# Altium schematic sheet BMS_TOP.SchDoc
size B; Organization: Altium Limited; Address1: L3, 12a Rodborough Rd; Address2: Frenchs Forest; Address3: NSW; Address4: Australia 2086
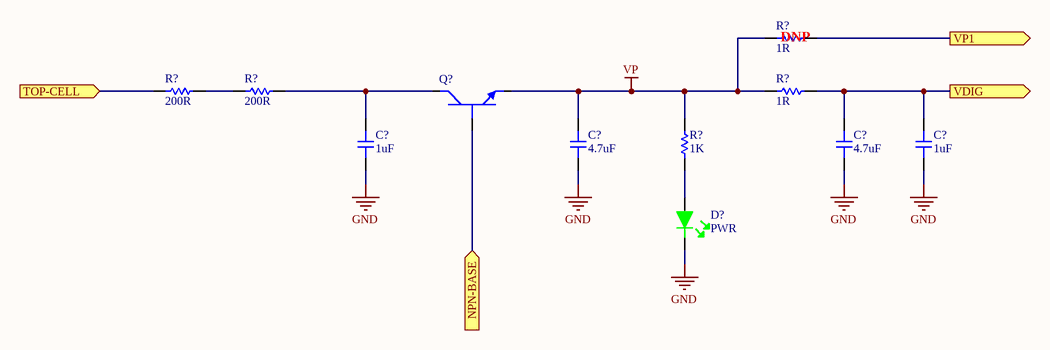
[diagram p0: BMS_TOP.SchDoc]

## Parts
(Parts that share a designator on the sheet are numbered #1, #2 ... from top to bottom, then left to right.)
C?#1  1uF  [CAP-0805]
C?#2  4.7uF  [CAP-0805]
C?#3  4.7uF  [CAP-0805]
C?#4  1uF  [CAP-0805]
D?  PWR  [LED-0603]
Q?  ZXTN4004KTCDICT-ND  [DPAK-TO252]  (value not drawn)
R?#1  1R  [RES-0603]
R?#2  200R  [RES-2512]
R?#3  200R  [RES-2512]
R?#4  1R  [RES-0603]
R?#5  1K  [RES-0603]

## Ports
NPN-BASE (in), TOP-CELL (in), VDIG (out), VP1 (out)

## Nets
GND: C?#1.1 C?#2.1 C?#3.1 C?#4.1 D?.2
VP: C?#2.2 Q?.3 R?#1.1 R?#4.1 R?#5.2
NPN-BASE: Q?.1 ; port NPN-BASE
TOP-CELL: R?#2.1 ; port TOP-CELL
VDIG: C?#3.2 C?#4.2 R?#4.2 ; port VDIG
VP1: R?#1.2 ; port VP1
NetC?#1_2: C?#1.2 Q?.2 R?#3.2
NetD?_1: D?.1 R?#5.1
NetR?#2_2: R?#2.2 R?#3.1

## Notes on the sheet
- (near R?#1) DNP
- Title
- Size:
- Date:
- Tabloid
- Number:
- Time:
- Revision:
- Sheet
- of
- File:

## Library data of the parts
C?#1 = 0805-1uF-50V: CAP CER 1UF 50V X5R 0805; Manufacturer: KEMET; Manufacturer Part Number: C0805C105K5PACTU; Dielectric Material: Ceramic; Tolerance: 10%; Supplier 1: Digi-Key; Stock 1: 7193; Pricing 1: 1=0.33, 10=0.23, 100=0.1378, 500=0.10334, 1000=0.08726 (USD); Mount: Surface Mount; Case/Package: 0805; Weight: 0.000194oz; Case Code (Metric): 2012; Case Code (Imperial): 0805; Min Operating Temperature: -55°C; Max Operating Temperature: 85°C; Voltage Rating: 50V; Dielectric: X5R; Packaging: Tape and Reel; Termination: SMD/SMT; Voltage Rating (DC): 50V; Package Quantity: 2500; Capacitance: 1uF; Length: 0.079inch; Width: 0.049inch; Thickness: 0.055inch; REACH SVHC: No SVHC; Lead Free: Lead Free; ComponentLink1URL: https://api.kemet.com/component-edge/download/datasheet/C0805C105K5PAC7800.pdf?src-supplier=Digi-Key; ComponentLink1Description: https://api.kemet.com/component-edge/download/datasheet/C0805C105K5PAC7800.pdf?src-supplier=Digi-Key; ComponentLink2URL: http://www.farnell.com/datasheets/2746140.pdf?src-supplier=Farnell; ComponentLink2Description: http://www.farnell.com/datasheets/2746140.pdf?src-supplier=Farnell; ComponentLink3URL: http://www.mouser.com/ds/2/212/KEM_C1006_X5R_SMD-1103249.pdf?src-supplier=Mouser; ComponentLink3Description: http://www.mouser.com/ds/2/212/KEM_C1006_X5R_SMD-1103249.pdf?src-supplier=Mouser; ComponentLink4URL: http://www.farnell.com/datasheets/2746140.pdf?src-supplier=Newark; ComponentLink4Description: http://www.farnell.com/datasheets/2746140.pdf?src-supplier=Newark; ComponentLink5URL: http://www.farnell.com/datasheets/2032728.pdf?src-supplier=Element14; ComponentLink5Description: http://www.farnell.com/datasheets/2032728.pdf?src-supplier=Element14; Supplier Part Number 1: 399-15436-6-ND
C?#2 C?#3 = 0805-4.7uF-16V: CAP CER 4.7UF 16V X5R 0805; Manufacturer: KEMET; Manufacturer Part Number: C0805C475K4PACTU; Dielectric Material: Ceramic; Tolerance: 10%; Supplier 1: Digi-Key; Stock 1: 96594; Pricing 1: 1=0.24, 10=0.168, 100=0.0951, 500=0.0671, 1000=0.05872 (USD); Mount: Surface Mount; Case/Package: 0805; Min Operating Temperature: -55°C; Max Operating Temperature: 85°C; Capacitance: 4.7uF; Packaging: Tape and Reel; Dielectric: X5R; Voltage: 16V; Termination: SMD/SMT; Voltage Rating (DC): 16V; Length: 2mm; Height: 1.25mm; Depth: 1.25mm; Radiation Hardening: No; Lead Free: Lead Free; ComponentLink1URL: http://capacitoredge.kemet.com/capedge2/DataSheet?pn=C0805C475K4PAC7800&src-supplier=Avnet+Europe; ComponentLink1Description: http://capacitoredge.kemet.com/capedge2/DataSheet?pn=C0805C475K4PAC7800&src-supplier=Avnet+Europe; ComponentLink2URL: https://www.verical.com/server-webapp/html/getDatasheet?partID=319476&src-supplier=Verical; ComponentLink2Description: https://www.verical.com/server-webapp/html/getDatasheet?partID=319476&src-supplier=Verical; Supplier Part Number 1: 399-8101-6-ND
C?#4 = 0805-1uF-16V: CAP CER 1UF 16V Y5V 0805; Manufacturer: KEMET; Manufacturer Part Number: C0805C105Z4VACTU; Dielectric Material: Ceramic; Tolerance: 80%; Dissipation Factor: 7%; Supplier 1: Digi-Key; Stock 1: 54729; Pricing 1: 1=0.12, 10=0.085, 100=0.0378, 500=0.02702, 1000=0.02124 (USD); Mount: Surface Mount,PCB; Case/Package: 0805; Number of Pins: 2; Case Code (Metric): 2012; Case Code (Imperial): 0805; Contact Material: Tin; Min Operating Temperature: -30°C; Max Operating Temperature: 85°C; Package Quantity: 1; Capacitance: 1uF; Voltage Rating: 16V; Packaging: Tape and Reel; Voltage Rating (DC): 16V; Dielectric: Y5V; Termination: SMD/SMT; Voltage: 16V; Length: 2mm; Height: 1.25mm; Width: 0.049inch; Thickness: 0.055inch; Lead Pitch: 0.75mm; Depth: 1.25mm; Radiation Hardening: No; REACH SVHC: No SVHC; Lead Free: Lead Free; ComponentLink1URL: http://www.farnell.com/datasheets/2739656.pdf?src-supplier=Farnell; ComponentLink1Description: http://www.farnell.com/datasheets/2739656.pdf?src-supplier=Farnell; ComponentLink2URL: http://capacitoredge.kemet.com/capedge2/DataSheet?pn=C0805C105Z4VAC7800&src-supplier=Avnet+Europe; ComponentLink2Description: http://capacitoredge.kemet.com/capedge2/DataSheet?pn=C0805C105Z4VAC7800&src-supplier=Avnet+Europe; ComponentLink3URL: https://www.alliedelec.com/m/d/9bfe7773041ffe9d406e68bc7b377fdd.pdf?src-supplier=Allied+Electronics; ComponentLink3Description: https://www.alliedelec.com/m/d/9bfe7773041ffe9d406e68bc7b377fdd.pdf?src-supplier=Allied+Electronics; ComponentLink4URL: http://www.farnell.com/datasheets/2739656.pdf?src-supplier=Newark; ComponentLink4Description: http://www.farnell.com/datasheets/2739656.pdf?src-supplier=Newark; Supplier Part Number 1: 399-8011-6-ND
D? = LED-Green: LED GREEN CLEAR 0603 SMD; Manufacturer: Wurth Electronics; Manufacturer Part Number: 150060VS75000; Luminous Intensity: 40mcd; Viewing Angle: 140°; Forward Voltage: 2V; Wavelength: 570nm; Lens Style: Clear,Rectangular; Forward Current: 30mA; Test Current: 20mA; Supplier 1: Digi-Key; Stock 1: 118118; Pricing 1: 1=0.14, 50=0.133, 100=0.114, 500=0.099 (USD); Mount: Surface Mount; Case/Package: 0603; Number of Pins: 2; Color: Green; Case Code (Metric): 1608; Case Code (Imperial): 0603; Min Operating Temperature: -40°C; Max Operating Temperature: 85°C; Package Quantity: 1; Packaging: Tape and Reel; Dominant Wavelength: 570nm; Length: 1.6mm; Height: 0.7mm; Width: 0.8mm; REACH SVHC: Unknown; ComponentLink1URL: https://katalog.we-online.de/led/datasheet/150060VS75000.pdf?src-supplier=Digi-Key; ComponentLink1Description: https://katalog.we-online.de/led/datasheet/150060VS75000.pdf?src-supplier=Digi-Key; Supplier Part Number 1: 732-4980-1-ND
Q? = NPN-150V-1A: TRANS NPN 150V 1A TO252; Manufacturer: Diodes; Max Power Dissipation: 3.8W; Number of Elements: 1; hFE Min: 100; Emitter Base Voltage (VEBO): 7V; Element Configuration: Single; Supplier 1: Digi-Key; Manufacturer Part Number: ZXTN4004KTC; Stock 1: 16465; Pricing 1: 1=0.44, 10=0.374, 25=0.3492, 100=0.2595, 250=0.24648, 500=0.20258, 1000=0.16465 (USD); Mount: Surface Mount; Case/Package: TO-252; Number of Pins: 3; Weight: 0.063493oz; Min Operating Temperature: -55°C; Max Operating Temperature: 150°C; Packaging: Tape and Reel; Package Quantity: 2500; Polarity: NPN; Collector Emitter Voltage (VCEO): 150V; Collector Base Voltage (VCBO): 150V; Continuous Collector Current: 1A; Max Collector Current: 1A; Collector Emitter Breakdown Voltage: 150V; Max Breakdown Voltage: 150V; Power Dissipation: 3.8W; Length: 6.7mm; Height: 6.2mm; Width: 2.39mm; Radiation Hardening: No; Lead Free: Lead Free; REACH SVHC: No SVHC; ComponentLink1URL: http://www.mouser.com/ds/2/115/ZXTN4004K-219140.pdf?src-supplier=Mouser; ComponentLink1Description: http://www.mouser.com/ds/2/115/ZXTN4004K-219140.pdf?src-supplier=Mouser; ComponentLink2URL: http://www.diodes.com/datasheets/ZXTN4004K.pdf?src-supplier=Avnet; ComponentLink2Description: http://www.diodes.com/datasheets/ZXTN4004K.pdf?src-supplier=Avnet; ComponentLink3URL: http://www.diodes.com/datasheets/ZXTN4004K.pdf?src-supplier=Avnet+Europe; ComponentLink3Description: http://www.diodes.com/datasheets/ZXTN4004K.pdf?src-supplier=Avnet+Europe; ComponentLink4URL: https://www.diodes.com/assets/Datasheets/ZXTN4004K.pdf?src-supplier=Digi-Key; ComponentLink4Description: https://www.diodes.com/assets/Datasheets/ZXTN4004K.pdf?src-supplier=Digi-Key; Supplier Part Number 1: ZXTN4004KTCDIDKR-ND
R?#1 R?#4 = 0603-1R: RES SMD 1 OHM 1% 1/10W 0603; Manufacturer: Yageo; Manufacturer Part Number: RC0603FR-071RL; Voltage Rating (DC): 50V; Temperature Coefficient: 200ppm/°C; Power Rating: 100mW; Supplier 1: Digi-Key; Stock 1: 9330143; Pricing 1: 1=0.1, 10=0.046, 100=0.0187, 1000=0.0084, 2500=0.00729 (USD); Case/Package: 0603; Number of Pins: 2; Case Code (Imperial): 0603; Case Code (Metric): 1608; Min Operating Temperature: -55°C; Max Operating Temperature: 155°C; Resistance: 1R; Tolerance: 1%; Packaging: Tape and Reel; Composition: Thick Film; Voltage Rating: 50V; Termination: SMD/SMT; Package Quantity: 1; Number of Terminations: 2; Max Power Dissipation: 100mW; Features: Moisture Resistant; Length: 0.063inch; Height: 0.022inch; Width: 0.031inch; Depth: 0.8mm; REACH SVHC: Unknown; Lead Free: Lead Free; ComponentLink1URL: http://www.yageo.com/documents/recent/PYu-RC_Group_51_RoHS_L_10.pdf?src-supplier=Digi-Key; ComponentLink1Description: http://www.yageo.com/documents/recent/PYu-RC_Group_51_RoHS_L_10.pdf?src-supplier=Digi-Key; ComponentLink2URL: http://www.farnell.com/datasheets/2167052.pdf?src-supplier=Element14; ComponentLink2Description: http://www.farnell.com/datasheets/2167052.pdf?src-supplier=Element14; ComponentLink3URL: http://www.farnell.com/datasheets/1868787.pdf?src-supplier=Element14; ComponentLink3Description: http://www.farnell.com/datasheets/1868787.pdf?src-supplier=Element14; Supplier Part Number 1: 311-1.00HRDKR-ND
R?#2 R?#3 = 2512-200R: RES SMD 200 OHM 1% 1W 2512; Manufacturer: Vishay; Manufacturer Part Number: CRCW2512200RFKEG; Temperature Coefficient: 100ppm/°C; Voltage Rating: 500V; Supplier 1: Digi-Key; Stock 1: 27582; Pricing 1: 1=0.38, 10=0.318, 100=0.1242, 1000=0.05198 (USD); Case/Package: 2512; Number of Pins: 2; Weight: 0.001429oz; Contact Plating: Tin; Case Code (Imperial): 2512; Case Code (Metric): 6432; Min Operating Temperature: -55°C; Max Operating Temperature: 155°C; Resistance: 200R; Power Rating: 1W; Tolerance: 1%; Packaging: Tape and Reel; Composition: Thick Film; Number of Terminations: 2; Military Standard: Not; Max Power Dissipation: 1W; Package Quantity: 10; Voltage Rating (DC): 500V; Termination: SMD/SMT; Features: Automotive AEC-Q200; Length: 6.3mm; Height: 0.028inch; Width: 3.15mm; Depth: 3.15mm; Radiation Hardening: No; Lead Free: Lead Free; REACH SVHC: Unknown; ComponentLink1URL: https://www.alliedelec.com/m/d/0c934d6939ccefa68dbe0b96d821c8cf.pdf?src-supplier=Allied+Electronics; ComponentLink1Description: https://www.alliedelec.com/m/d/0c934d6939ccefa68dbe0b96d821c8cf.pdf?src-supplier=Allied+Electronics; ComponentLink2URL: http://www.vishay.com/docs/20035/dcrcwe3.pdf?src-supplier=Digi-Key; ComponentLink2Description: http://www.vishay.com/docs/20035/dcrcwe3.pdf?src-supplier=Digi-Key; ComponentLink3URL: http://www.vishay.com/docs/20035/dcrcwe3.pdf?src-supplier=Avnet; ComponentLink3Description: http://www.vishay.com/docs/20035/dcrcwe3.pdf?src-supplier=Avnet; ComponentLink4URL: http://www.vishay.com/docs/20035/dcrcwe3.pdf?src-supplier=Future+Electronics; ComponentLink4Description: http://www.vishay.com/docs/20035/dcrcwe3.pdf?src-supplier=Future+Electronics; Supplier Part Number 1: 541-200AFDKR-ND
R?#5 = 0603-1KR: RES SMD 1K OHM 1% 1/10W 0603; Manufacturer: Vishay Dale; Manufacturer Part Number: CRCW06031K00FKEA; Resistance: 1kR; Power Rating: 100mW; Voltage Rating: 75V; Temperature Coefficient: 100ppm/°C; Supplier 1: Digi-Key; Stock 1: 671453; Pricing 1: 1=0.1, 10=0.034, 100=0.0139, 1000=0.00623, 2500=0.0054 (USD); Mount: Surface Mount; Case/Package: 0603; Number of Pins: 2; Weight: 7.1E-05oz; Case Code (Metric): 1608; Case Code (Imperial): 0603; Contact Plating: Tin; Min Operating Temperature: -55°C; Max Operating Temperature: 155°C; Composition: Thick Film; Tolerance: 1%; Packaging: Tape and Reel; Package Quantity: 10; Number of Terminations: 2; Termination: SMD/SMT; Military Standard: Not; Max Power Dissipation: 100mW; Voltage Rating (DC): 75V; Features: Automotive AEC-Q200; Length: 1.55mm; Height: 0.45mm; Width: 0.033inch; Depth: 0.85mm; Radiation Hardening: No; REACH SVHC: Unknown; Lead Free: Lead Free; ComponentLink1URL: http://www.vishay.com/docs/20035/dcrcwe3.pdf?src-supplier=Digi-Key; ComponentLink1Description: http://www.vishay.com/docs/20035/dcrcwe3.pdf?src-supplier=Digi-Key; ComponentLink2URL: http://uk.rs-online.com/webdocs/0d98/0900766b80d98afc.pdf?src-supplier=RSComponents; ComponentLink2Description: http://uk.rs-online.com/webdocs/0d98/0900766b80d98afc.pdf?src-supplier=RSComponents; ComponentLink3URL: http://www.vishay.com/docs/20035/dcrcwe3.pdf?src-supplier=Avnet; ComponentLink3Description: http://www.vishay.com/docs/20035/dcrcwe3.pdf?src-supplier=Avnet; ComponentLink4URL: http://www.vishay.com/docs/20035/dcrcwe3.pdf?src-supplier=Avnet+Asia; ComponentLink4Description: http://www.vishay.com/docs/20035/dcrcwe3.pdf?src-supplier=Avnet+Asia; ComponentLink5URL: http://www.farnell.com/datasheets/2310790.pdf?src-supplier=Element14; ComponentLink5Description: http://www.farnell.com/datasheets/2310790.pdf?src-supplier=Element14; ComponentLink6URL: https://www.distrelec.biz/Web/Downloads/a_/en/flD-CRCW-e3_data_en.pdf?mime=application%2Fpdf&src-supplier=Distrelec; ComponentLink6Description: https://www.distrelec.biz/Web/Downloads/a_/en/flD-CRCW-e3_data_en.pdf?mime=application%2Fpdf&src-supplier=Distrelec; ComponentLink7URL: http://www.vishay.com/docs/20035/dcrcwe3.pdf?src-supplier=Future+Electronics; ComponentLink7Description: http://www.vishay.com/docs/20035/dcrcwe3.pdf?src-supplier=Future+Electronics; ComponentLink8URL: http://www.vishay.com/docs/20035/dcrcwe3.pdf?src-supplier=Avnet+Europe; ComponentLink8Description: http://www.vishay.com/docs/20035/dcrcwe3.pdf?src-supplier=Avnet+Europe; Supplier Part Number 1: 541-1.00KHCT-ND